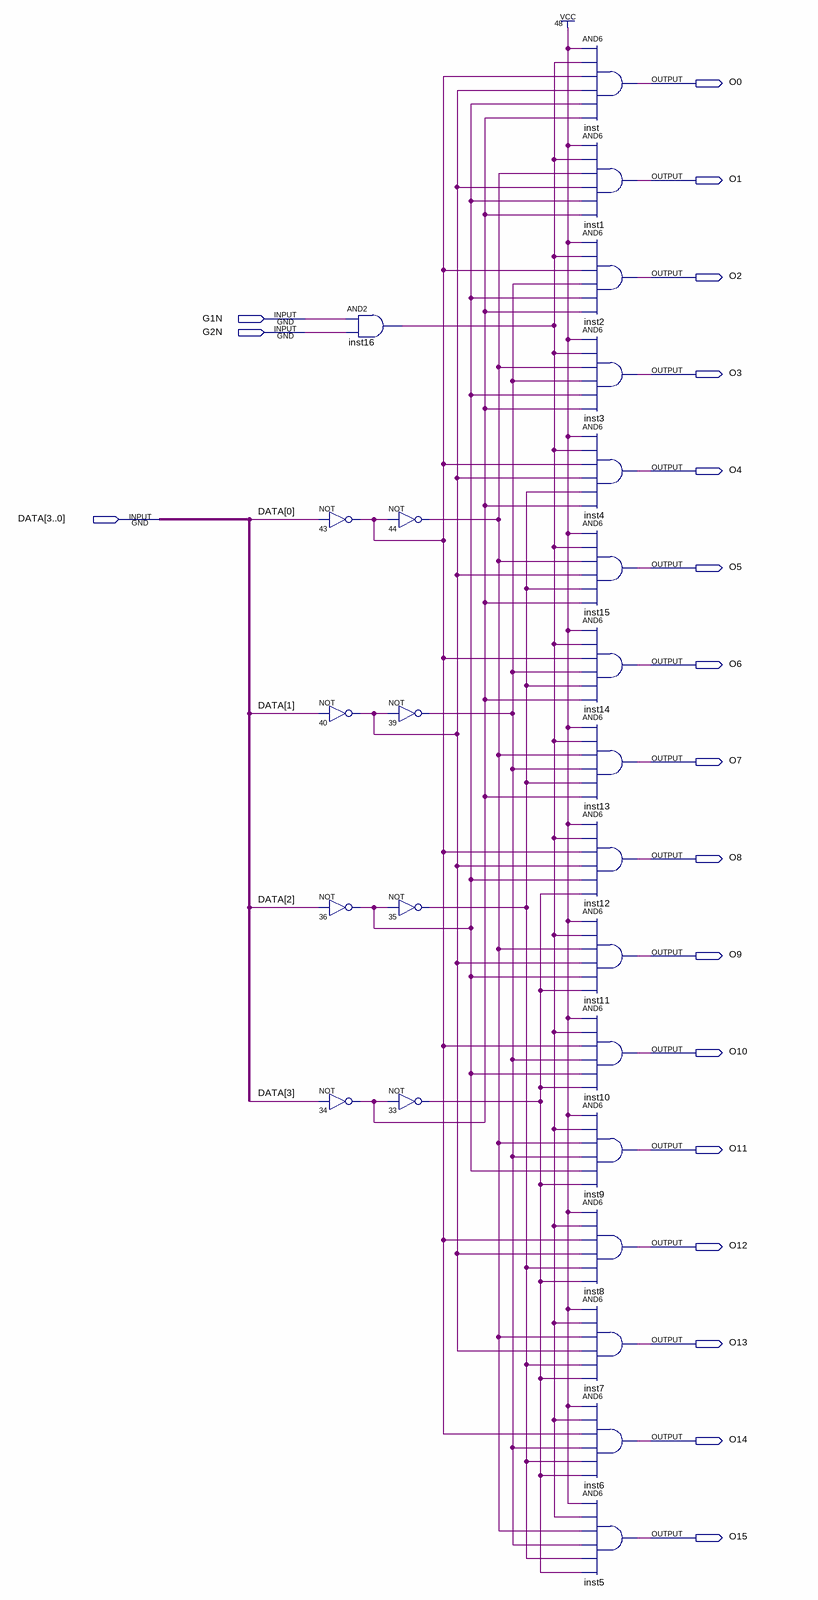
[diagram p0: schematic sheet]
// Quartus schematic decode16.bdf as structural Verilog: 25 symbols, 19 pins
module decode16 (
  input  G1N,
  input  G2N,
  input  [3:0] DATA,
  output O0,
  output O1,
  output O2,
  output O3,
  output O4,
  output O5,
  output O6,
  output O7,
  output O8,
  output O9,
  output O10,
  output O11,
  output O12,
  output O13,
  output O14,
  output O15
);

  wire inst16_out, n33_out, n34_out, n35_out, n36_out, n39_out, n40_out, n43_out, n44_out;

  not u_43 (n43_out, DATA[0]);
  not u_40 (n40_out, DATA[1]);
  not u_36 (n36_out, DATA[2]);
  not u_34 (n34_out, DATA[3]);
  and inst16 (inst16_out, G1N, G2N);
  not u_44 (n44_out, n43_out);
  not u_39 (n39_out, n40_out);
  not u_35 (n35_out, n36_out);
  not u_33 (n33_out, n34_out);
  and inst (O0, 1'b1, inst16_out, n43_out, n40_out, n36_out, n34_out);
  and inst1 (O1, 1'b1, inst16_out, n44_out, n40_out, n36_out, n34_out);
  and inst2 (O2, 1'b1, inst16_out, n43_out, n39_out, n36_out, n34_out);
  and inst3 (O3, 1'b1, inst16_out, n44_out, n39_out, n36_out, n34_out);
  and inst4 (O4, 1'b1, inst16_out, n43_out, n40_out, n35_out, n34_out);
  and inst15 (O5, 1'b1, inst16_out, n44_out, n40_out, n35_out, n34_out);
  and inst14 (O6, 1'b1, inst16_out, n43_out, n39_out, n35_out, n34_out);
  and inst13 (O7, 1'b1, inst16_out, n44_out, n39_out, n35_out, n34_out);
  and inst12 (O8, 1'b1, inst16_out, n43_out, n40_out, n36_out, n33_out);
  and inst11 (O9, 1'b1, inst16_out, n44_out, n40_out, n36_out, n33_out);
  and inst10 (O10, 1'b1, inst16_out, n43_out, n39_out, n36_out, n33_out);
  and inst9 (O11, 1'b1, inst16_out, n44_out, n39_out, n36_out, n33_out);
  and inst8 (O12, 1'b1, inst16_out, n43_out, n40_out, n35_out, n33_out);
  and inst7 (O13, 1'b1, inst16_out, n44_out, n40_out, n35_out, n33_out);
  and inst6 (O14, 1'b1, inst16_out, n43_out, n39_out, n35_out, n33_out);
  and inst5 (O15, 1'b1, inst16_out, n44_out, n39_out, n35_out, n33_out);
endmodule
